# Altium schematic sheet Thermocouple interface.SchDoc: Thermocouple interface
size A4; CheckedBy: none; Organization: ORGANIZATION; Address1: ADDRESS 1; Address2: ADDRESS 2; Address3: ADDRESS 3; Address4: ADDRESS 4; Revision: -; SheetNumber: 4; SheetTotal: 5; ENG_APP_DATE: --/--/--; DSN_APP_DATE: --/--/--; CHK_APP_DATE: --/--/--
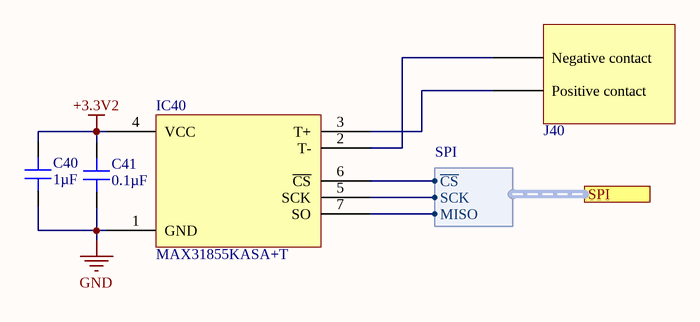
[diagram p0: Thermocouple interface.SchDoc]

## Parts
C40  1µF  [CAP 1206_3216 - 1.8MM]
C41  0.1µF  [CAP 1206_3216 - 1.8MM]
IC40  MAX31855KASA+T  [MAXIM SOIC-8 S8]
J40  IKM-K-PCB  [IM-K-PCB]  (value not drawn)

## Ports
SPI (harness SPI)

## Harnesses
SPI: ~{CS}, SCK, MISO

## Nets
+3.3V2: C40.2 C41.2 IC40.4(VCC)
GND: C40.1 C41.1 IC40.1(GND)
NetIC40_2: IC40.2(T-) J40.1(Negative_contact)
NetIC40_3: IC40.3(T+) J40.0(Positive_contact)
NetIC40_5: IC40.5(SCK) ; port SPI.SCK
NetIC40_6: IC40.6(~{CS}) ; port SPI.~{CS}
NetIC40_7: IC40.7(SO) ; port SPI.MISO

## Notes on the sheet
- Project:
- Title:
- Drawn by:
- Date and time:
- Checked by:
- Budapest University of Technology and Economics
- Faculty of Electrical Engineering and Informatics
- Sheet
- of
- Size:
- A4
- Revision:

## Library data of the parts
C40 = C1206F105M5RACAUTO: CAP CER 1UF 50V X7R 1206; Manufacturer: KEMET; Tolerance: ±20%; Part Number: C1206F105M5RACAUTO; Value: 1µF; Applications: Automotive; Capacitance: 1µF; ComponentLink1Description: Datasheet; ComponentLink1URL: https://api.kemet.com/component-edge/download/datasheet/C1206F105M5RACAUTO.pdf; ComponentLink2Description: DigiKey Link; ComponentLink2URL: http://digikey.com/product-detail/en/kemet/C1206F105M5RACAUTO/399-13313-1-ND/5879283; Device Package: 1206 (3216 Metric); Features: Open Mode; LastUpdated: 2020. 09. 02. 1:05:40; Lifecycle Status: Active; Minimum Order: 1; Mounting Type: Surface Mount, MLCC; Operating Temperature: -55°C ~ 125°C; Package / Case: 1206 (3216 Metric); Packaging: TapeAndReel; PartId: 19986; Part Status: Active; Price: 0.21; Ratings: AEC-Q200; Series: SMD Auto X7R FO; Size / Dimension: 0.126" L x 0.063" W (3.20mm x 1.60mm); Supplier 1: DigiKey; Supplier Part Number 1: 399-13313-1-ND; Temperature Coefficient: X7R; Thickness (Max): 0.071" (1.80mm); Voltage - Rated: 50V
C41 = C1206X104K5RECAUTO: CAP CER 0.1UF 50V X7R 1206; Manufacturer: KEMET; Tolerance: ±10%; Part Number: C1206X104K5RECAUTO; Value: 0.1µF; Applications: Automotive, Boardflex Sensitive, ESD Protection; Capacitance: 0.1µF; ComponentLink1Description: Datasheet; ComponentLink1URL: https://api.kemet.com/component-edge/download/datasheet/C1206X104K5RECAUTO.pdf; ComponentLink2Description: DigiKey Link; ComponentLink2URL: http://digikey.com/product-detail/en/kemet/C1206X104K5RECAUTO/399-17853-1-ND/8640520; Device Package: 1206 (3216 Metric); Features: Soft Termination; LastUpdated: 2020. 09. 02. 1:05:27; Lifecycle Status: Active; Minimum Order: 1; Mounting Type: Surface Mount, MLCC; Operating Temperature: -55°C ~ 125°C; Package / Case: 1206 (3216 Metric); Packaging: TapeAndReel; PartId: 22292; Part Status: Active; Price: 0.13; Ratings: AEC-Q200; Series: ESD SMD Auto X7R; Size / Dimension: 0.130" L x 0.063" W (3.30mm x 1.60mm); Supplier 1: DigiKey; Supplier Part Number 1: 399-17853-1-ND; Temperature Coefficient: X7R; Thickness (Max): 0.055" (1.40mm); Voltage - Rated: 50V
IC40 = MAX31855KASA+T: IC CONV THERMOCOUPLE-DGTL 8SOIC; Manufacturer: Maxim Integrated; Current - Supply: 900µA; Input Type: Thermocouple (Multiple); Output Type: Digital; Part Number: MAX31855KASA+T; ComponentLink1Description: Datasheet; ComponentLink1URL: https://datasheets.maximintegrated.com/en/ds/MAX31855.pdf; ComponentLink2Description: DigiKey Link; ComponentLink2URL: http://digikey.com/product-detail/en/maxim-integrated/MAX31855KASA-T/MAX31855KASA-TCT-ND/2708805; LastUpdated: 2020. 09. 02. 1:27:08; Lifecycle Status: Active; Minimum Order: 1; Mounting Type: Surface Mount; Operating Temperature: -40°C ~ 125°C; Package / Case: 8-SOIC (0.154", 3.90mm Width); Packaging: TapeAndReel; Part Status: Active; Price: 3.35; Series: -; Supplier 1: DigiKey; Supplier Part Number 1: MAX31855KASA+TCT-ND; Supplier Device Package: 8-SOIC; Type: Thermocouple to Digital Converter
J40 = IKM-K-PCB: Miniature Thermocouple PCB Mounting Socket; Manufacturer: Lab Facility; Supplier 1: Farnell; ComponentLink1Description: Datasheet; ComponentLink1URL: http://www.farnell.com/datasheets/2842097.pdf; ComponentLink2Description: 3D animaton; ComponentLink2URL: https://www.youtube.com/watch?v=aBtMT_bWiLk